# Altium project GSMGPSMC60_2.PrjPcb
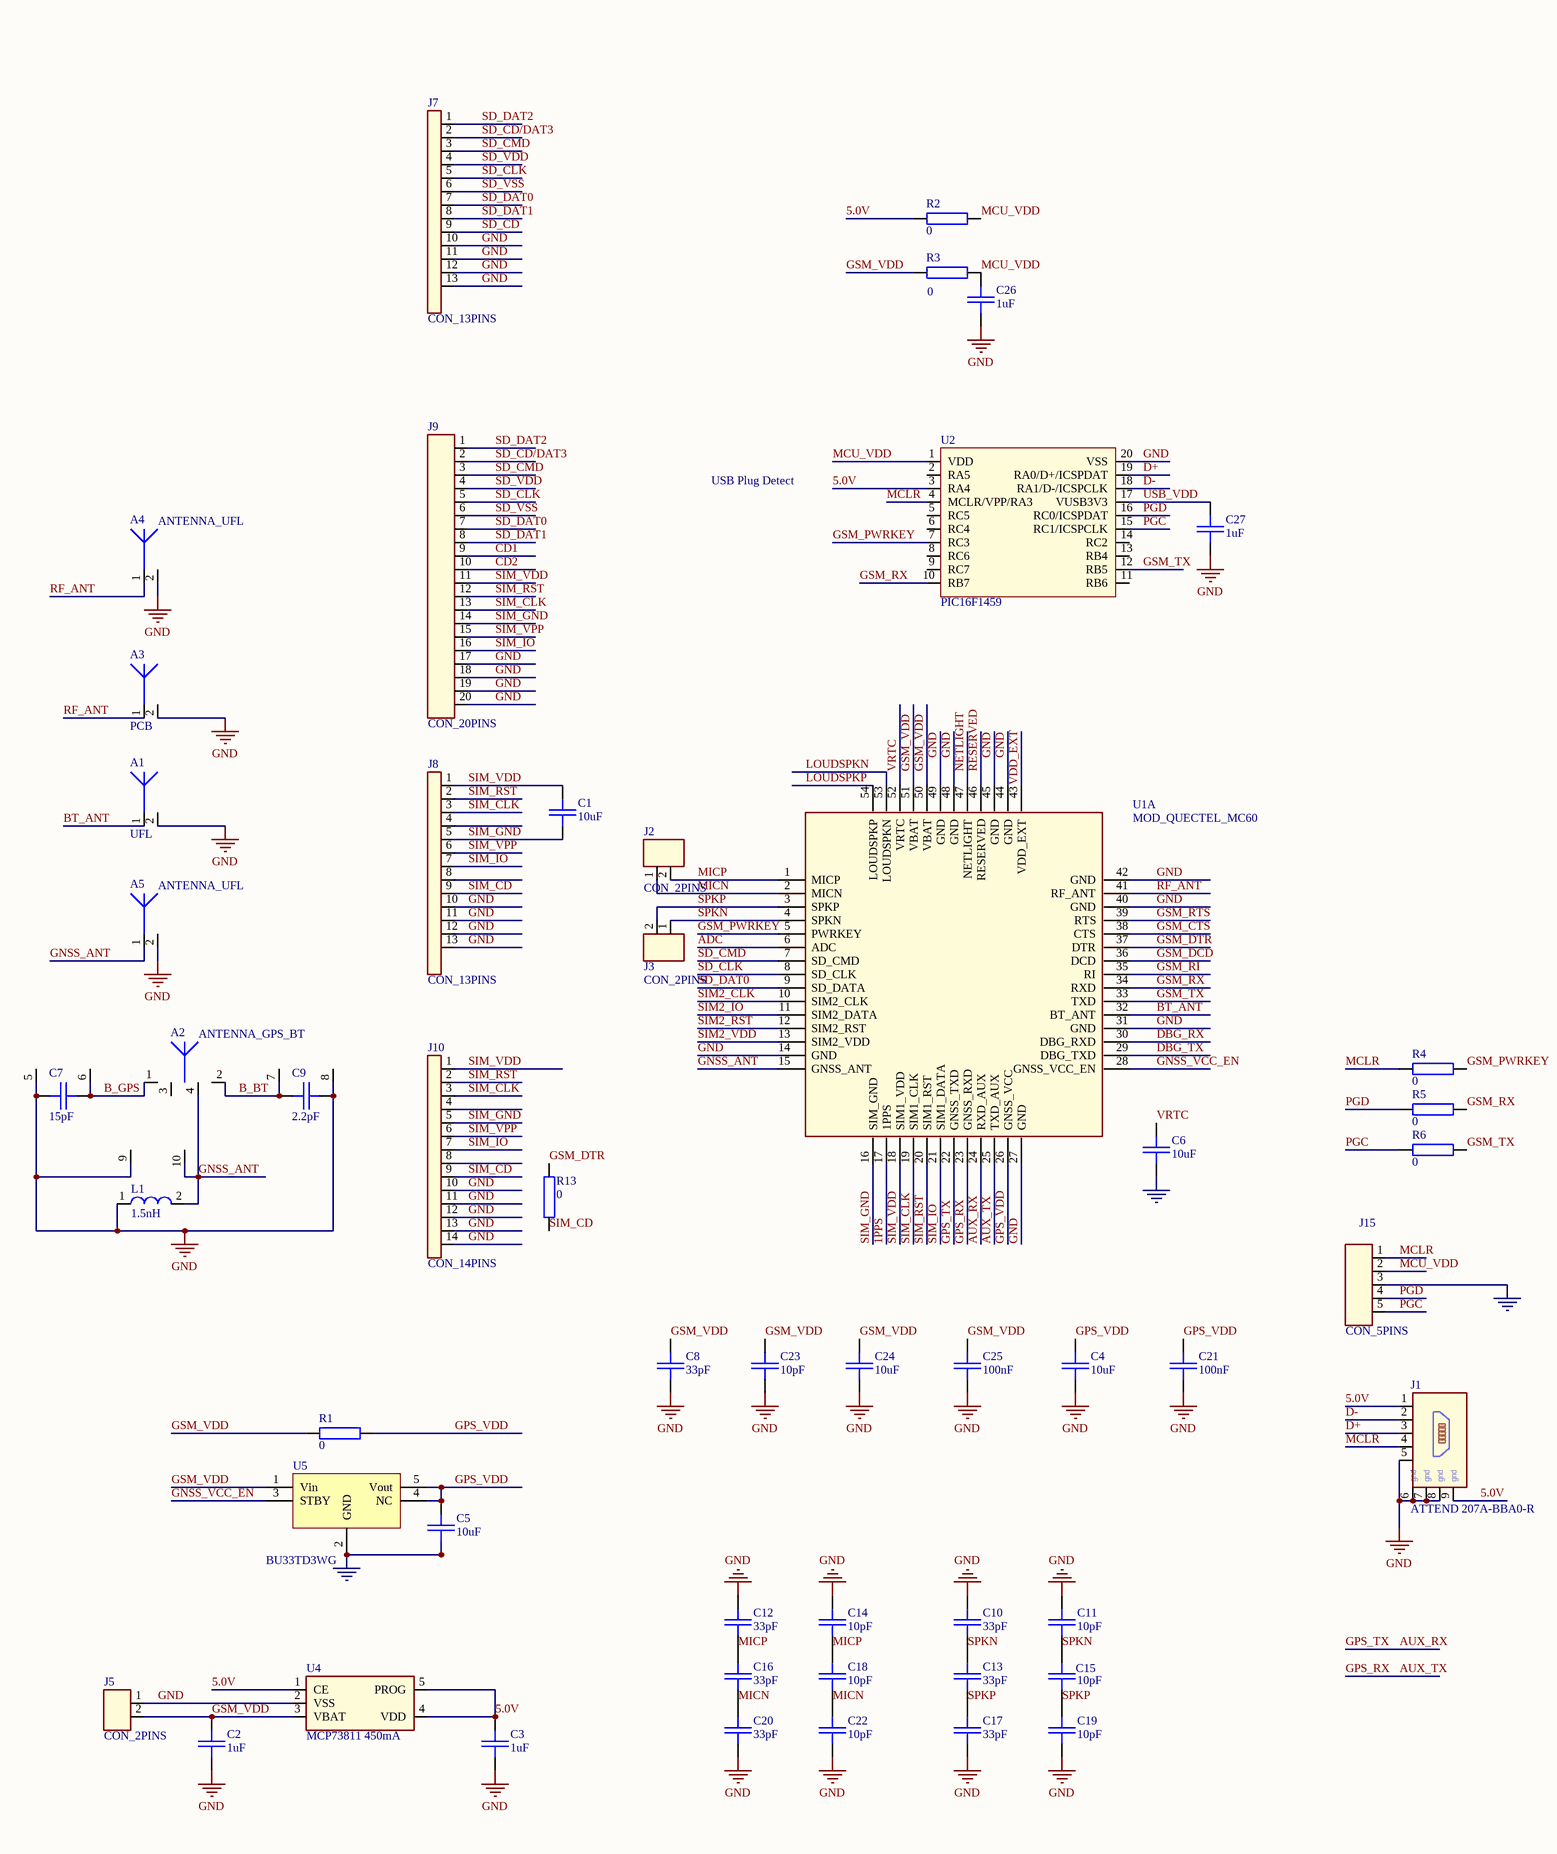
[diagram p0: GSMGPSMC60_2.SchDoc, left]
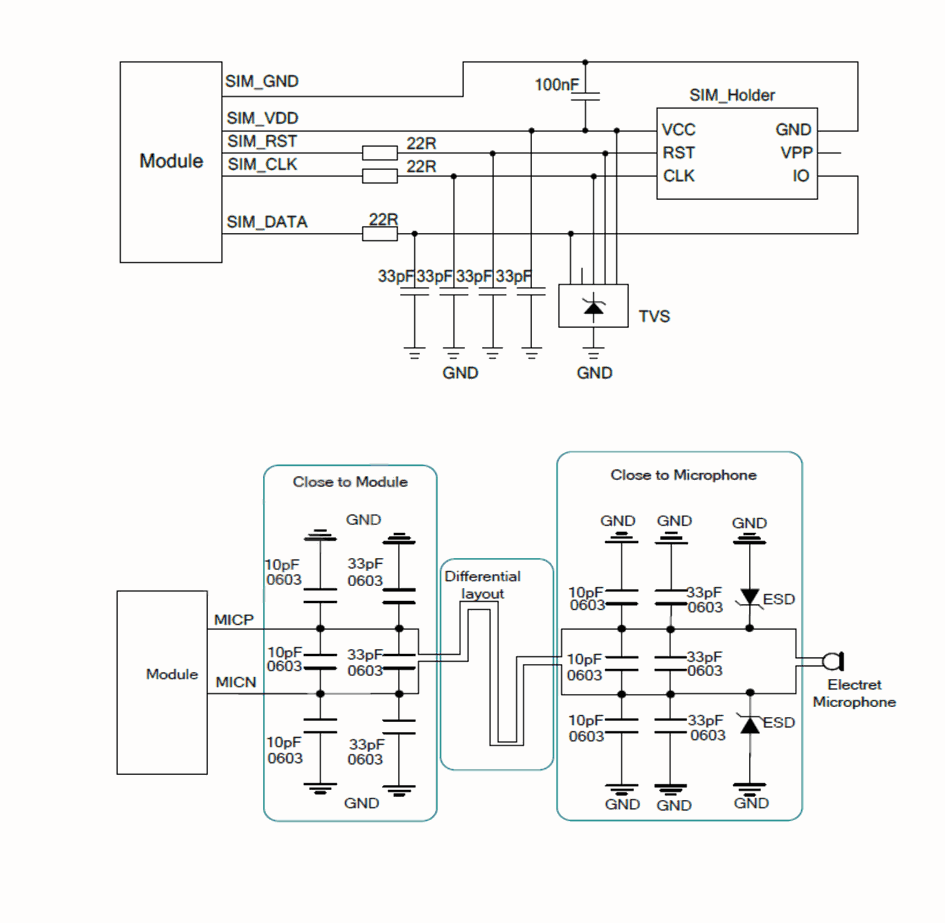
[diagram p1: GSMGPSMC60_2.SchDoc, right]
1 sheet, 53 parts. Net scope: global (net labels, ports and power ports of the same name join across sheets).
Board file: GSMGPSMC60_2.PcbDoc

## Sheet GSMGPSMC60_2.SchDoc
size A2

### Parts
A1  UFL  [SMD_CON_ANTENNA_UFL]
A2  ANTENNA_GPS_BT  [SMD_CHIP_ANTENNA_GPS_BT - FLIP]
A3  PCB  [SMD_CON_ANTENNA_GSM_PCB]
A4  ANTENNA_UFL  [SMD_CON_ANTENNA_UFL]
A5  ANTENNA_UFL  [SMD_CON_ANTENNA_UFL]
C1  10uF  [SMD_0402_CAPC1005X90N]
C2  1uF  [SMD_0402_CAPC1005X90N]
C3  1uF  [SMD_0402_CAPC1005X90N]
C4  10uF  [SMD_0402_CAPC1005X90N]
C5  10uF  [SMD_0402_CAPC1005X90N]
C6  10uF  [SMD_0402_CAPC1005X90N]
C7  15pF  [SMD_0402_CAPC1005X90N - ANTENNA]
C8  33pF  [SMD_0402_CAPC1005X90N]
C9  2.2pF  [SMD_0201_CAPC0603X33N - ANTENNA]
C10  33pF  [SMD_0402_CAPC1005X90N]
C11  10pF  [SMD_0402_CAPC1005X90N]
C12  33pF  [SMD_0402_CAPC1005X90N]
C13  33pF  [SMD_0402_CAPC1005X90N]
C14  10pF  [SMD_0402_CAPC1005X90N]
C15  10pF  [SMD_0402_CAPC1005X90N]
C16  33pF  [SMD_0402_CAPC1005X90N]
C17  33pF  [SMD_0402_CAPC1005X90N]
C18  10pF  [SMD_0402_CAPC1005X90N]
C19  10pF  [SMD_0402_CAPC1005X90N]
C20  33pF  [SMD_0402_CAPC1005X90N]
C21  100nF  [SMD_0402_CAPC1005X90N]
C22  10pF  [SMD_0402_CAPC1005X90N]
C23  10pF  [SMD_0402_CAPC1005X90N]
C24  10uF  [SMD_0402_CAPC1005X90N]
C25  100nF  [SMD_0402_CAPC1005X90N]
C26  1uF  [SMD_0402_CAPC1005X90N]
C27  1uF  [SMD_0402_CAPC1005X90N]
J1  ATTEND 207A-BBA0-R  [SMD_CON_MICRO_USB]
J2  CON_2PINS  [PTH_MIC_6MM_2.7MM_PITCH1.9]
J3  CON_2PINS  [PTH_MIC_6MM_2.7MM_PITCH1.9]
J5  CON_2PINS  [PTH_HDRV02W64P254_1X02]
J7  CON_13PINS  [NONE]
J8  CON_13PINS  [SMD_CON-ATTEND_MICRO_SIM_115Q-BCA0]
J9  CON_20PINS  [NONE]
J10  CON_14PINS  [NONE]
J15  CON_5PINS  [SIP5 - PGM]
L1  1.5nH  [SMD_0402_INDC1005X55N - ANTENNA]
R1  0  [SMD_0402_RESC1005X37N]
R2  0  [SMD_0402_RESC1005X37N]
R3  0  [SMD_0402_RESC1005X37N]
R4  0  [SMD_0402_RESC1005X37N]
R5  0  [SMD_0402_RESC1005X37N]
R6  0  [SMD_0402_RESC1005X37N]
R13  0  [SMD_0402_RESC1005X37N]
U1  MOD_QUECTEL_MC60  [SMD_MOD_MC60_54_PIN]  (part A of 2)
U2  PIC16F1459  [SMD_QFN50P400X400X90-21N]
U4  MCP73811 450mA  [SMD_SOT26_SOT95P285X140-5N - DLV]
U5  BU33TD3WG  [SMD_SOT26_SOT95P285X140-5N - DLV]

### Nets
GND: A1.2 A2.5 A2.8 A2.9 A3.2 A4.2 A5.2 C2.2 C3.2 C4.2 C5.2 C6.2 C7.1 C8.2 C9.2 C10.1 C11.1 C12.1 C14.1 C17.2 C19.2 C20.2 C21.2 C22.2 C23.2 C24.2 C25.2 C26.2 C27.2 J1.5 J1.6 J1.7 J1.8 J5.1 J7.10 J7.11 J7.12 J7.13 J8.10 J8.11 J8.12 J8.13 J9.17 J9.18 J9.19 J9.20 J10.10 J10.11 J10.12 J10.13 J10.14 J15.3 L1.1 U1.14(GND) U1.27(GND) U1.31(GND) U1.40(GND) U1.42(GND) U1.44(GND) U1.45(GND) U1.48(GND) U1.49(GND) U2.20(VSS) U4.2(VSS) U5.2(GND)
1PPS: U1.17(1PPS)
5.0V: C3.1 J1.1 J1.9 R2.1 U2.3(RA4) U4.1(CE) U4.4(VDD) U4.5(PROG)
ADC: U1.6(ADC)
AUX_RX: U1.22(GNSS_TXD) U1.24(RXD_AUX)  [also labelled GPS_TX]
AUX_TX: U1.23(GNSS_RXD) U1.25(TXD_AUX)  [also labelled GPS_RX]
B_BT: A2.2 A2.7 C9.1
B_GPS: A2.1 A2.6 C7.2
BT_ANT: A1.1 U1.32(BT_ANT)
CD1: J9.9
CD2: J9.10
D+: J1.3 U2.19(RA0/D+/ICSPDAT)
D-: J1.2 U2.18(RA1/D-/ICSPCLK)
DBG_RX: U1.30(DBG_RXD)
DBG_TX: U1.29(DBG_TXD)
GNSS_ANT: A2.4 A2.10 A5.1 L1.2 U1.15(GNSS_ANT)
GNSS_VCC_EN: U1.28(GNSS_VCC_EN) U5.3(STBY)
GPS_VDD: C4.1 C5.1 C21.1 R1.2 U1.26(GNSS_VCC) U5.4(NC) U5.5(Vout)
GSM_CTS: U1.38(CTS)
GSM_DCD: U1.36(DCD)
GSM_DTR: R13.1 U1.37(DTR)
GSM_PWRKEY: R4.2 U1.5(PWRKEY) U2.7(RC3)
GSM_RI: U1.35(RI)
GSM_RTS: U1.39(RTS)
GSM_RX: R5.2 U1.34(RXD) U2.10(RB7)
GSM_TX: R6.2 U1.33(TXD) U2.12(RB5)
GSM_VDD: C2.1 C8.1 C23.1 C24.1 C25.1 J5.2 R1.1 R3.1 U1.50(VBAT) U1.51(VBAT) U4.3(VBAT) U5.1(Vin)
LOUDSPKN: U1.53(LOUDSPKN)
LOUDSPKP: U1.54(LOUDSPKP)
MCLR: J1.4 J15.1 R4.1 U2.4(MCLR/VPP/RA3)
MCU_VDD: C26.1 J15.2 R2.2 R3.2 U2.1(VDD)
MICN: C16.2 C18.2 C20.1 C22.1 J2.1 U1.2(MICN)
MICP: C12.2 C14.2 C16.1 C18.1 J2.2 U1.1(MICP)
NETLIGHT: U1.47(NETLIGHT)
PGC: J15.5 R6.1 U2.15(RC1/ICSPCLK)
PGD: J15.4 R5.1 U2.16(RC0/ICSPDAT)
RESERVED: U1.46(RESERVED)
RF_ANT: A3.1 A4.1 U1.41(RF_ANT)
SD_CD: J7.9
SD_CD/DAT3: J7.2 J9.2
SD_CLK: J7.5 J9.5 U1.8(SD_CLK)
SD_CMD: J7.3 J9.3 U1.7(SD_CMD)
SD_DAT0: J7.7 J9.7 U1.9(SD_DATA)
SD_DAT1: J7.8 J9.8
SD_DAT2: J7.1 J9.1
SD_VDD: J7.4 J9.4
SD_VSS: J7.6 J9.6
SIM2_CLK: U1.10(SIM2_CLK)
SIM2_IO: U1.11(SIM2_DATA)
SIM2_RST: U1.12(SIM2_RST)
SIM2_VDD: U1.13(SIM2_VDD)
SIM_CD: J8.9 J10.9 R13.2
SIM_CLK: J8.3 J9.13 J10.3 U1.19(SIM1_CLK)
SIM_GND: C1.2 J8.5 J9.14 J10.5 U1.16(SIM_GND)
SIM_IO: J8.7 J9.16 J10.7 U1.21(SIM1_DATA)
SIM_RST: J8.2 J9.12 J10.2 U1.20(SIM1_RST)
SIM_VDD: C1.1 J8.1 J9.11 J10.1 U1.18(SIM1_VDD)
SIM_VPP: J8.6 J9.15 J10.6
SPKN: C10.2 C11.2 C13.1 C15.1 J3.1 U1.4(SPKN)
SPKP: C13.2 C15.2 C17.1 C19.1 J3.2 U1.3(SPKP)
USB_VDD: C27.1 U2.17(VUSB3V3)
VDD_EXT: U1.43(VDD_EXT)
VRTC: C6.1 U1.52(VRTC)

Not connected (* = marked no-connect by the designer): A2 3; J8 4 8; J10 4 8; U2 2(RA5) 5(RC5) 6(RC4) 8(RC6) 9(RC7) 11(RB6) 13(RB4) 14(RC2)

### Notes on the sheet
- USB Plug Detect
- (in symbol CON_USB_MINI) gnd

### Library data of the parts
A1 A3-A5 = ANTENNA_2: NOTE: <NOTE>
A2 = ANTENNA_GPS_BT: NOTE: <NOTE>
C1-C27 = C: NOTE: <NOTE>
J1 = CON_USB_MINI: NOTE: <NOTE>
J2 J3 J5 = CON_2PINS: NOTE: <NOTE>
J15 = CON_5PINS: NOTE: <NOTE>
L1 = L
R1-R6 R13 = R: NOTE: <NOTE>; R_BDS: R
U2 = IC_PIC16F1459
U4 = IC_MCP73812: MCP73812; DB_PART_NUMBER: PSU000000127; DB_PART_TYPE: Linear Voltage Regulator; DB_MANUFACTURER_PART: ROHM        BD33KA5WF-E2; DB_T_RANGE: -40 to 105; DB_VOLTAGE: 3.3V; DB_CURRENT: 500mA; DB_PACKAGE: SOIC-8; DB_DESCRIPTION: IC BD33KA5WF-E2 SOIC-8; DB_PCB_DEVICE: SMD_SOIC127P620X160-8N; DB_CERTIFIED: ISHIDDEN=T; DB_APPROVED_BY: VSN; DB_APPROVED_ON: 07.5.2014 г. 13:18:28; DB_STATUS: NEW; DB_DATASHEET: http://john.epiqdesign.com/projects/CIS_Datasheets/IC_bdxxka5wf-e-209388.pdf?rev=1408&sc=0
U5 = IC_BU33TD3WG
U1 = MOD_QUECTEL_MC60: PCB DECAL: *

## Assembly variants
Production: not fitted Q1 Q2